# Altium project Nhom7_lednhaytheonhac.PrjPcb
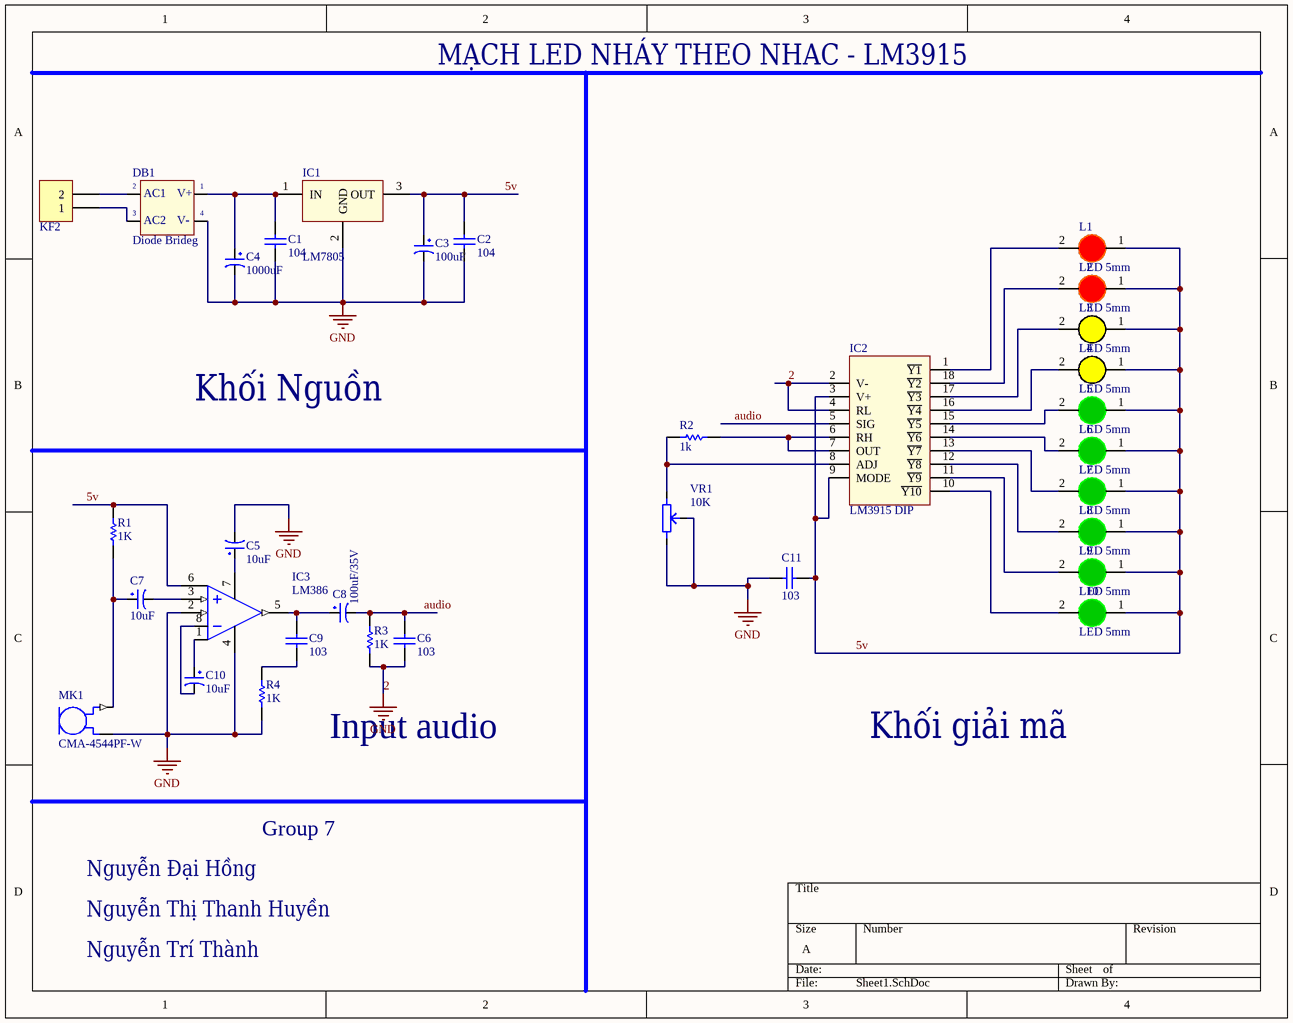
[diagram p0: Sheet1.SchDoc]
1 sheet, 32 parts. Net scope: global (net labels, ports and power ports of the same name join across sheets).
Board files: PCB1.PcbDoc, PCB2.PcbDoc

## Sheet Sheet1.SchDoc
size A

### Parts
C1  104  [tu gom]
C2  104  [tu gom]
C3  100uF  [Tu hoa 10mm]
C4  1000uF  [tu hoa 13mm]
C5  10uF  [CP1/2]
C6  103  [tu gom]
C7  10uF  [CP1/2]
C8  100uF/35V  [CP1.5/3.4]
C9  103  [tu gom]
C10  10uF  [CP1/2]
C11  103  [tu gom]
DB1  Diode Brideg  [CAU 1A]
IC1  LM7805  [QTO-220]
IC2  LM3915 DIP  [DIP18]
IC3  LM386  [DIP8]
L1  LED 5mm  [LED-5MM-RED]
L2  LED 5mm  [LED-5MM-RED]
L3  LED 5mm  [LED-5MM-Yellow]
L4  LED 5mm  [LED-5MM-Yellow]
L5  LED 5mm  [LED-5MM-Green]
L6  LED 5mm  [LED-5MM-Green]
L7  LED 5mm  [LED-5MM-Green]
L8  LED 5mm  [LED-5MM-Green]
L9  LED 5mm  [LED-5MM-Green]
L10  LED 5mm  [LED-5MM-Green]
MK1  CMA-4544PF-W  [MIC_CMA-4544PF-W]
R1  value 1K  [R1/4W]  (hidden comment: Res1)
R2  value 1k  [R1/4W1]  (hidden comment: Res1)
R3  value 1K  [R1/4W]  (hidden comment: Res1)
R4  value 1K  [R1/4W]  (hidden comment: Res1)
VR1  10K  [Bien Tro Tam Giac Dung]
  KF2  [KF2-3.5]

### Nets
2: C1.2 C2.2 C3.2 C4.2 C5.2 C6.2 C11.1 DB1.4(-V_OUT) IC1.2(GND) IC2.2(V-) IC2.4(RL) IC3.2(IN-) IC3.4(-V) MK1.2(GND) R3.1 R4.1 VR1.2 VR1.3  [also labelled GND]
5v: C2.1 C3.1 C11.2 IC1.3(OUT) IC2.3(V+) IC2.9(MODE) IC3.6(OUT) L1.1(A) L2.1(A) L3.1(A) L4.1(A) L5.1(A) L6.1(A) L7.1(A) L8.1(A) L9.1(A) L10.1(A) R1.2
audio: C6.1 C8.2 IC2.5(SIG) R3.2
NetC1_1: C1.1 C4.1 DB1.1(+V_OUT) IC1.1(IN)
NetC5_1: C5.1 IC3.7(+V)
NetC7_1: C7.1 MK1.1(OUT) R1.1
NetC7_2: C7.2 IC3.3(IN+)
NetC8_1: C8.1 C9.1 IC3.5(out)
NetC9_2: C9.2 R4.2
NetC10_1: C10.1 IC3.1(-V)
NetC10_2: C10.2 IC3.8(-V)
NetDB1_2: DB1.2(AC1) .2
NetDB1_3: DB1.3(AC2) .1
NetIC2_1: IC2.1(~{Y1}) L1.2(K)
NetIC2_6: IC2.6(RH) IC2.7(OUT) R2.2
NetIC2_8: IC2.8(ADJ) R2.1 VR1.1
NetIC2_10: IC2.10(~{Y10}) L10.2(K)
NetIC2_11: IC2.11(~{Y9}) L9.2(K)
NetIC2_12: IC2.12(~{Y8}) L8.2(K)
NetIC2_13: IC2.13(~{Y7}) L7.2(K)
NetIC2_14: IC2.14(~{Y6}) L6.2(K)
NetIC2_15: IC2.15(~{Y5}) L5.2(K)
NetIC2_16: IC2.16(~{Y4}) L4.2(K)
NetIC2_17: IC2.17(~{Y3}) L3.2(K)
NetIC2_18: IC2.18(~{Y2}) L2.2(K)

### Notes on the sheet
- MẠCH LED NHÁY THEO NHAC - LM3915
- Khối Nguồn
- Input audio
- Khối giải mã
- Group 7
- Nguyễn Đại Hồng
- Nguyễn Thị Thanh Huyền
- Nguyễn Trí Thành
- (in symbol DB) V+; V-

### Library data of the parts
C1 C2 = Tu gom 104 50V: Cắm; So_Chan: 2; Ten_Linh_Kien: Tụ gốm 104 100nF 50V; Don_Vi: Con; Ma_Hang: MH004761; Chung_Loai: Cắm; Kieu_Chan: *
C3 = Tu Hoa 100uF 100V 10x20: Cắm; Don_Vi: Con; So_Chan: 2; Ten_Linh_Kien: Tụ Hóa 100uF 100V 10x20MM; Ma_Hang: MH003150; Chung_Loai: Cắm; Kieu_Chan: *
C4 = Tu Hoa 1000uF 25V 13x21: Cắm; Don_Vi: Con; So_Chan: 2; Ten_Linh_Kien: Tụ Hóa 1000uF 25V 13x21MM; Ma_Hang: MH002315; Chung_Loai: Cắm; Kieu_Chan: *
C5 C7 C10 = CP1: Cap P  0,1uF < 22uF , 16 - 50V; Value: 10uF/50V; Description 1: 10 => 220uF/6,3V/10V - 10uF => 100uF/16V; Description 2: 0,1uF => 33uF/50V - 10uF => 22uF/63V; Description 3: 0,47uF => 10uF/100V
C6 C9 C11 = Tu gom 103 50V: Cắm; So_Chan: 2; Ten_Linh_Kien: Tụ gốm 103 10nF 50V; Don_Vi: Con; Ma_Hang: MH000936; Chung_Loai: Cắm; Kieu_Chan: *
C8 = CP3: Cap 100uF/35V - 470uF/16V; Value: 100uF/35V/50V; Description 1: 1000uF/6,3V - 470uF/16V - 330uF - 25V; Description 2: 220uF/35V - 100uF/50V - 63V - 4,7uF/200V; Description 3: 22uF => 33uF100V - 3,3uF => 4,7uF/250V; Description 4: 2,2uF =>3,3uF/350 - 2,2uF/400V - 1uF/450V
DB1 = DB: Convert AC to DC voltage, 4 pin; Value: Cau 1A
IC1 = LM78xx: On ap +, from + 5 to + 24VDC; Value: LM7805
IC2 = LM3914 DIP: Cắm; Ten_Linh_Kien: LM3914 DIP18; Don_Vi: Con; Ma_Hang: MH002419; Ghi_Chu: *; Kieu_Chan: *; Chung_Loai: Cắm
IC3 = LM386: Low-Power Dual Operational Amplifier; Value: LM358
L1 L2 = LED 5mm Do: Cắm; Don_Vi: Con; Ma_Hang: MH008967; Ten_Linh_Kien: Led 5MM Phủ Đỏ (1000c); Ghi_Chu: *; Kieu_Chan: *; Chung_Loai: Cắm
L3 L4 = LED 5mm Vang: Cắm; Don_Vi: Con; Ma_Hang: MH008968; Ten_Linh_Kien: Led 5MM Phủ Vàng (1000c); Ghi_Chu: *; Kieu_Chan: *; Chung_Loai: Cắm
L5-L10 = LED 5mm Xanh La: Cắm; Don_Vi: Con; Ma_Hang: MH008969; Ten_Linh_Kien: LED 5MM Phủ Xanh (1000c); Ghi_Chu: *; Kieu_Chan: *; Chung_Loai: Cắm
MK1 = CMA-4544PF-W: CMA Series 9.7 mm Electret Condenser Omni-Directional Pin Mount 3 V Microphone; Package: None; Availability: Unavailable; Value: *; MP: CMA-4544PF-W; Price: None
R1 R3 R4 = Res1_4: Resistor; Manufacturer: Generic Components; Class: Passive; Published: 08/06/2000; Publisher: Altium Hobart Technology Centre; SubClass: Resistor
R2 = Res1_2: Resistor; Manufacturer: Generic Components; Class: Passive; Published: 08/06/2000; Publisher: Altium Hobart Technology Centre; SubClass: Resistor
VR1 = Bien tro tam giac 10K Dung: Cắm; Ma_Hang: MH000919; Don_Vi: Con; Ten_Linh_Kien: Biến Trở Tam Giác 103-10K RM065 (Chân Đứng); Chung_Loai: Cắm; Kieu_Chan: *
 = KF2: Manufacturer: Würth Elektronik eiSos GmbH; partNo: 691103110002; ComponentLink1 Description: Manufacturer; ComponentLink2 Description: Datasheet; NoPins: 2; Created Date: 29 October 2013; ComponentLink1URL: http://www.we-online.com; ComponentLink2URL: http://katalog.we-online.de/em/datasheet/6911031100xx.pdf; Created by: Karrer Zheng